# Altium schematic sheet Core429IBaseBoardVerE.SchDoc
size A2
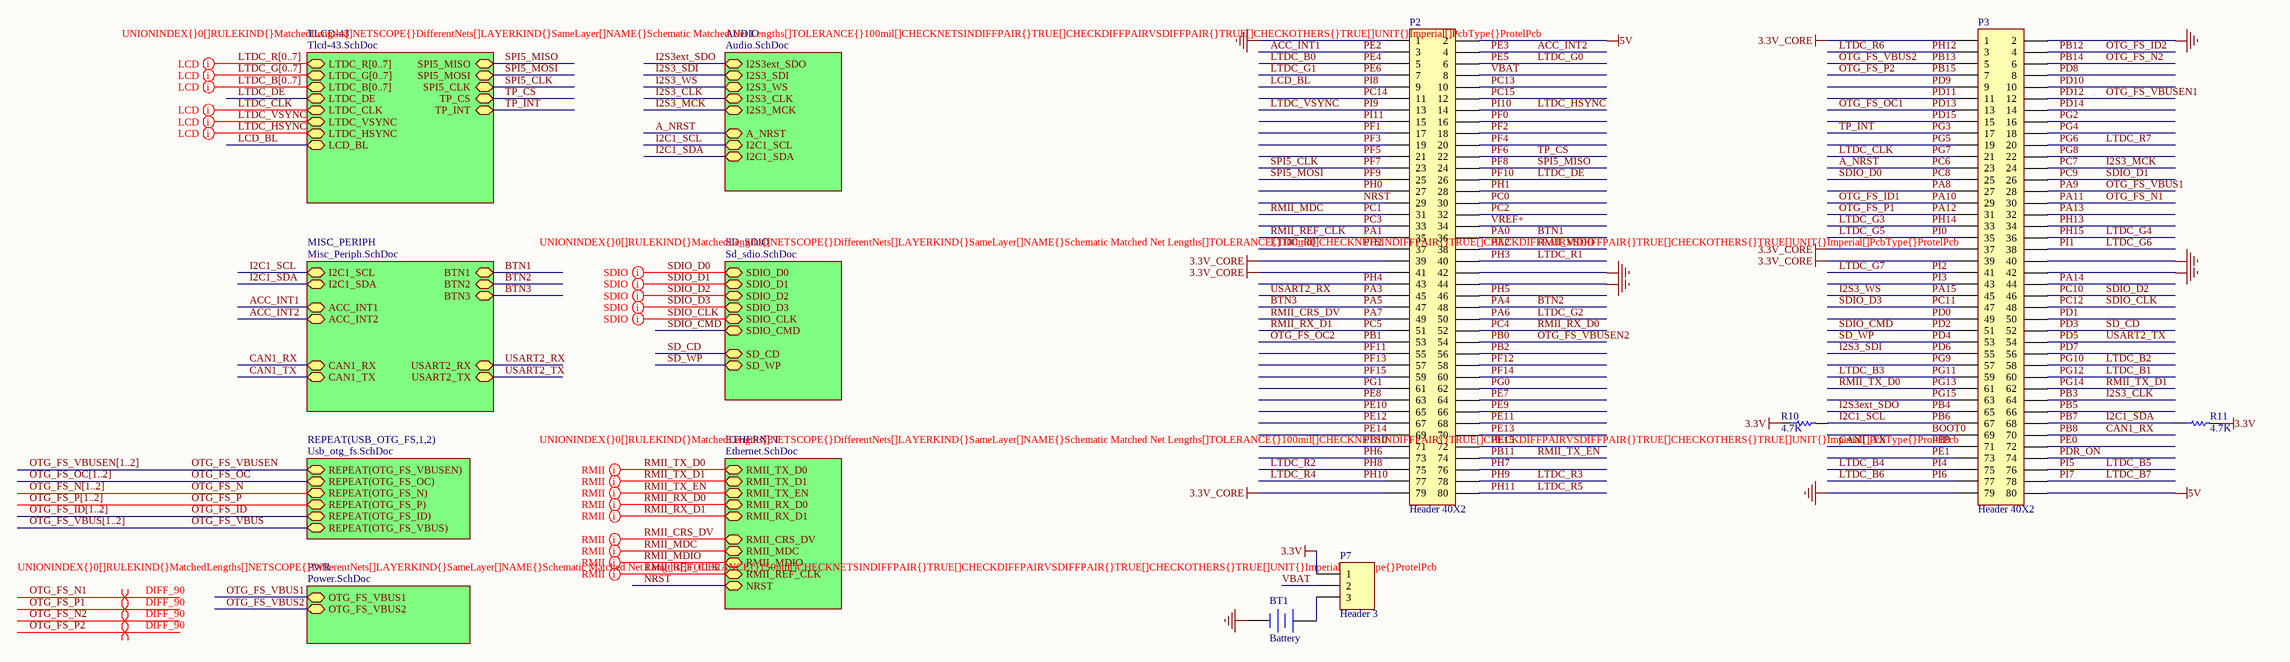
[diagram p0: Core429IBaseBoardVerE.SchDoc]

## Parts
BT1  Battery  [PN3000]
P2  Header 40X2  [SHDR2X40]
P3  Header 40X2  [SHDR2X40]
P7  Header 3  [HDR1X3]
R10  value 4.7K  [RESC2012N]  (hidden comment: Res)
R11  value 4.7K  [RESC2012N]  (hidden comment: Res)

## Sub-sheets
AUDIO = Audio.SchDoc: I2S3_SDI, I2S3_WS, I2S3_CLK, I2S3_MCK, A_NRST, I2C1_SCL, I2C1_SDA, I2S3ext_SDO
ETHERNET = Ethernet.SchDoc: RMII_TX_D0, RMII_TX_D1, RMII_TX_EN, RMII_RX_D0, RMII_RX_D1, RMII_CRS_DV, RMII_MDC, RMII_MDIO, RMII_REF_CLK, NRST
MISC_PERIPH = Misc_Periph.SchDoc: I2C1_SCL, I2C1_SDA, ACC_INT1, ACC_INT2, BTN3, BTN2, BTN1, CAN1_RX, CAN1_TX, USART2_TX, USART2_RX
PWR = Power.SchDoc: OTG_FS_VBUS1, OTG_FS_VBUS2
REPEAT(USB_OTG_FS,1,2) = Usb_otg_fs.SchDoc: REPEAT(OTG_FS_VBUSEN), REPEAT(OTG_FS_OC), REPEAT(OTG_FS_N), REPEAT(OTG_FS_P), REPEAT(OTG_FS_ID), REPEAT(OTG_FS_VBUS)
SD_SDIO = Sd_sdio.SchDoc: SDIO_D0, SDIO_D1, SDIO_D2, SDIO_D3, SDIO_CLK, SDIO_CMD, SD_CD, SD_WP
TLCD-43 = Tlcd-43.SchDoc: LTDC_R[0..7], LTDC_G[0..7], LTDC_B[0..7], LTDC_DE, LTDC_CLK, LTDC_VSYNC, LTDC_HSYNC, LCD_BL, TP_INT, TP_CS, SPI5_CLK, SPI5_MOSI, SPI5_MISO

## Nets
3.3V: P7.1 R10.1 R11.2
3.3V_CORE: P2.39 P2.41 P2.79 P3.1 P3.37 P3.39
5V: P2.2 P3.80
DGND: BT1.2(-) P2.1 P2.42 P2.44 P3.2 P3.40 P3.42 P3.79
A_NRST: P3.23 ; sheet AUDIO/A_NRST  [also labelled PC6]
ACC_INT1: P2.3 ; sheet MISC_PERIPH/ACC_INT1  [also labelled PE2]
ACC_INT2: P2.4 ; sheet MISC_PERIPH/ACC_INT2  [also labelled PE3]
BOOT0: P3.69
BTN1: P2.36 ; sheet MISC_PERIPH/BTN1  [also labelled PA0]
BTN2: P2.48 ; sheet MISC_PERIPH/BTN2  [also labelled PA4]
BTN3: P2.47 ; sheet MISC_PERIPH/BTN3  [also labelled PA5]
CAN1_RX: P3.70 ; sheet MISC_PERIPH/CAN1_RX  [also labelled PB8]
CAN1_TX: P3.71 ; sheet MISC_PERIPH/CAN1_TX  [also labelled PB9]
I2C1_SCL: P3.67 R10.2 ; sheet AUDIO/I2C1_SCL, sheet MISC_PERIPH/I2C1_SCL  [also labelled PB6]
I2C1_SDA: P3.68 R11.1 ; sheet AUDIO/I2C1_SDA, sheet MISC_PERIPH/I2C1_SDA  [also labelled PB7]
I2S3_CLK: P3.64 ; sheet AUDIO/I2S3_CLK  [also labelled PB3]
I2S3_MCK: P3.24 ; sheet AUDIO/I2S3_MCK  [also labelled PC7]
I2S3_SDI: P3.55 ; sheet AUDIO/I2S3_SDI  [also labelled PD6]
I2S3_WS: P3.45 ; sheet AUDIO/I2S3_WS  [also labelled PA15]
I2S3ext_SDO: P3.65 ; sheet AUDIO/I2S3ext_SDO  [also labelled PB4]
LCD_BL: P2.9 ; sheet TLCD-43/LCD_BL  [also labelled PI8]
LTDC_B0: P2.5  [also labelled PE4]
LTDC_B1: P3.60  [also labelled PG12]
LTDC_B2: P3.58  [also labelled PG10]
LTDC_B3: P3.59  [also labelled PG11]
LTDC_B4: P3.75  [also labelled PI4]
LTDC_B5: P3.76  [also labelled PI5]
LTDC_B6: P3.77  [also labelled PI6]
LTDC_B7: P3.78  [also labelled PI7]
LTDC_CLK: P3.21 ; sheet TLCD-43/LTDC_CLK  [also labelled PG7]
LTDC_DE: P2.26 ; sheet TLCD-43/LTDC_DE  [also labelled PF10]
LTDC_G0: P2.6  [also labelled PE5]
LTDC_G1: P2.7  [also labelled PE6]
LTDC_G2: P2.50  [also labelled PA6]
LTDC_G3: P3.33  [also labelled PH14]
LTDC_G4: P3.36  [also labelled PH15]
LTDC_G5: P3.35  [also labelled PI0]
LTDC_G6: P3.38  [also labelled PI1]
LTDC_G7: P3.41  [also labelled PI2]
LTDC_HSYNC: P2.14 ; sheet TLCD-43/LTDC_HSYNC  [also labelled PI10]
LTDC_R0: P2.37  [also labelled PH2]
LTDC_R1: P2.40  [also labelled PH3]
LTDC_R2: P2.75  [also labelled PH8]
LTDC_R3: P2.78  [also labelled PH9]
LTDC_R4: P2.77  [also labelled PH10]
LTDC_R5: P2.80  [also labelled PH11]
LTDC_R6: P3.3  [also labelled PH12]
LTDC_R7: P3.20  [also labelled PG6]
LTDC_VSYNC: P2.13 ; sheet TLCD-43/LTDC_VSYNC  [also labelled PI9]
NRST: P2.29 ; sheet ETHERNET/NRST
OTG_FS_ID: sheet REPEAT(USB_OTG_FS,1,2)/REPEAT(OTG_FS_ID)
OTG_FS_ID1: P3.29  [also labelled PA10]
OTG_FS_ID2: P3.4  [also labelled PB12]
OTG_FS_N: sheet REPEAT(USB_OTG_FS,1,2)/REPEAT(OTG_FS_N)
OTG_FS_N1: P3.30  [also labelled PA11]
OTG_FS_N2: P3.6  [also labelled PB14]
OTG_FS_OC: sheet REPEAT(USB_OTG_FS,1,2)/REPEAT(OTG_FS_OC)
OTG_FS_OC1: P3.13  [also labelled PD13]
OTG_FS_OC2: P2.53  [also labelled PB1]
OTG_FS_P: sheet REPEAT(USB_OTG_FS,1,2)/REPEAT(OTG_FS_P)
OTG_FS_P1: P3.31  [also labelled PA12]
OTG_FS_P2: P3.7  [also labelled PB15]
OTG_FS_VBUS: sheet REPEAT(USB_OTG_FS,1,2)/REPEAT(OTG_FS_VBUS)
OTG_FS_VBUS1: P3.28 ; sheet PWR/OTG_FS_VBUS1  [also labelled PA9]
OTG_FS_VBUS2: P3.5 ; sheet PWR/OTG_FS_VBUS2  [also labelled PB13]
OTG_FS_VBUSEN: sheet REPEAT(USB_OTG_FS,1,2)/REPEAT(OTG_FS_VBUSEN)
OTG_FS_VBUSEN1: P3.12  [also labelled PD12]
OTG_FS_VBUSEN2: P2.54  [also labelled PB0]
PA1: P2.35 ; sheet ETHERNET/RMII_REF_CLK  [also labelled RMII_REF_CLK]
PA2: P2.38 ; sheet ETHERNET/RMII_MDIO  [also labelled RMII_MDIO]
PA3: P2.45 ; sheet MISC_PERIPH/USART2_RX  [also labelled USART2_RX]
PA7: P2.49 ; sheet ETHERNET/RMII_CRS_DV  [also labelled RMII_CRS_DV]
PA8: P3.27
PA13: P3.32
PA14: P3.44
PB2: P2.56
PB5: P3.66
PB10: P2.71
PB11: P2.74 ; sheet ETHERNET/RMII_TX_EN  [also labelled RMII_TX_EN]
PC0: P2.30
PC1: P2.31 ; sheet ETHERNET/RMII_MDC  [also labelled RMII_MDC]
PC2: P2.32
PC3: P2.33
PC4: P2.52 ; sheet ETHERNET/RMII_RX_D0  [also labelled RMII_RX_D0]
PC5: P2.51 ; sheet ETHERNET/RMII_RX_D1  [also labelled RMII_RX_D1]
PC8: P3.25 ; sheet SD_SDIO/SDIO_D0  [also labelled SDIO_D0]
PC9: P3.26 ; sheet SD_SDIO/SDIO_D1  [also labelled SDIO_D1]
PC10: P3.46 ; sheet SD_SDIO/SDIO_D2  [also labelled SDIO_D2]
PC11: P3.47 ; sheet SD_SDIO/SDIO_D3  [also labelled SDIO_D3]
PC12: P3.48 ; sheet SD_SDIO/SDIO_CLK  [also labelled SDIO_CLK]
PC13: P2.10
PC14: P2.11
PC15: P2.12
PD0: P3.49
PD1: P3.50
PD2: P3.51 ; sheet SD_SDIO/SDIO_CMD  [also labelled SDIO_CMD]
PD3: P3.52 ; sheet SD_SDIO/SD_CD  [also labelled SD_CD]
PD4: P3.53 ; sheet SD_SDIO/SD_WP  [also labelled SD_WP]
PD5: P3.54 ; sheet MISC_PERIPH/USART2_TX  [also labelled USART2_TX]
PD7: P3.56
PD8: P3.8
PD9: P3.9
PD10: P3.10
PD11: P3.11
PD14: P3.14
PD15: P3.15
PDR_ON: P3.74
PE0: P3.72
PE1: P3.73
PE7: P2.64
PE8: P2.63
PE9: P2.66
PE10: P2.65
PE11: P2.68
PE12: P2.67
PE13: P2.70
PE14: P2.69
PE15: P2.72
PF0: P2.16
PF1: P2.17
PF2: P2.18
PF3: P2.19
PF4: P2.20
PF5: P2.21
PF6: P2.22 ; sheet TLCD-43/TP_CS  [also labelled TP_CS]
PF7: P2.23 ; sheet TLCD-43/SPI5_CLK  [also labelled SPI5_CLK]
PF8: P2.24 ; sheet TLCD-43/SPI5_MISO  [also labelled SPI5_MISO]
PF9: P2.25 ; sheet TLCD-43/SPI5_MOSI  [also labelled SPI5_MOSI]
PF11: P2.55
PF12: P2.58
PF13: P2.57
PF14: P2.60
PF15: P2.59
PG0: P2.62
PG1: P2.61
PG2: P3.16
PG3: P3.17 ; sheet TLCD-43/TP_INT  [also labelled TP_INT]
PG4: P3.18
PG5: P3.19
PG8: P3.22
PG9: P3.57
PG13: P3.61 ; sheet ETHERNET/RMII_TX_D0  [also labelled RMII_TX_D0]
PG14: P3.62 ; sheet ETHERNET/RMII_TX_D1  [also labelled RMII_TX_D1]
PG15: P3.63
PH0: P2.27
PH1: P2.28
PH4: P2.43
PH5: P2.46
PH6: P2.73
PH7: P2.76
PH13: P3.34
PI3: P3.43
PI11: P2.15
VBAT: P2.8 P7.2
VREF+: P2.34
NetBT1_1: BT1.1(+) P7.3

## Buses and harness runs
bus LTDC_B[0..7] = sheet TLCD-43/LTDC_B[0..7]
bus LTDC_G[0..7] = sheet TLCD-43/LTDC_G[0..7]
bus LTDC_R[0..7] = sheet TLCD-43/LTDC_R[0..7]
bus OTG_FS_ID[1..2]
bus OTG_FS_N[1..2]
bus OTG_FS_OC[1..2]
bus OTG_FS_P[1..2]
bus OTG_FS_VBUS[1..2]
bus OTG_FS_VBUSEN[1..2]

## Layout directives
net class RMII; rule Matched Net Lengths [Tolerance = 100mil]: PA1, PA2, PA7, PB11, PC1, PC4, PC5, PG13, PG14
net class LCD; rule Matched Net Lengths [Tolerance = 100mil]: (no net found under the mark), LTDC_CLK, LTDC_HSYNC, LTDC_VSYNC
differential pair; net class DIFF_90; rule Matched Net Lengths [Tolerance = 150mil]: OTG_FS_N1, OTG_FS_N2, OTG_FS_P1, OTG_FS_P2
net class SDIO; rule Matched Net Lengths [Tolerance = 100mil]: PC8, PC9, PC10, PC11, PC12

## Library data of the parts
BT1 = Battery: Multicell Battery
P2 P3 = Header 40X2: Header, 40-Pin, Dual row
P7 = Header 3: Header, 3-Pin
R10 R11 = Res: Resistor